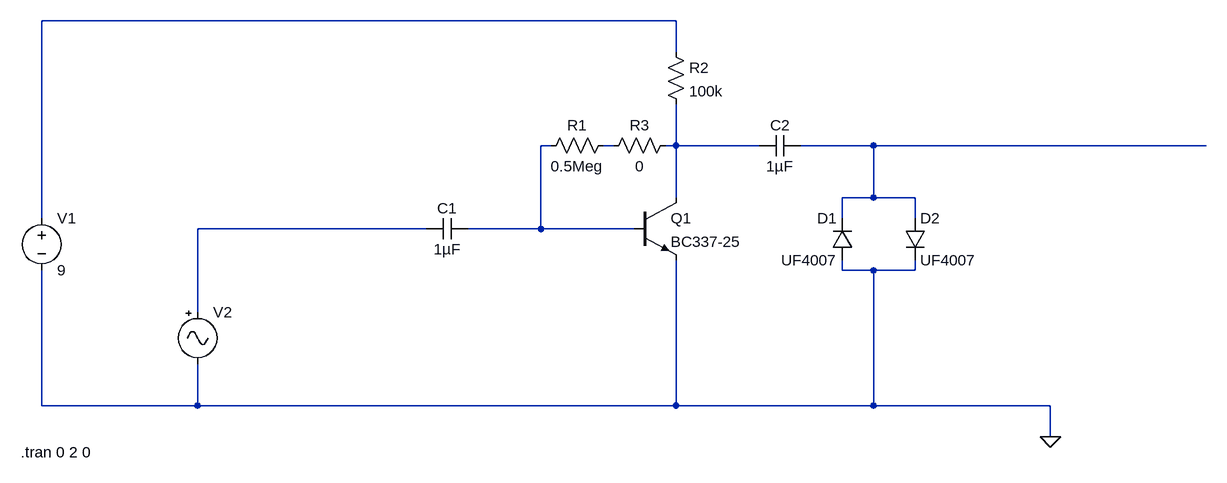
[diagram p0: schematic distortion 00.asc]
distortion 00.asc, the LTspice schematic file:
Version 4
SHEET 1 1700 680
WIRE 480 -224 -496 -224
WIRE 480 -176 480 -224
WIRE 288 -32 272 -32
WIRE 384 -32 368 -32
WIRE 480 -32 480 -96
WIRE 480 -32 464 -32
WIRE 608 -32 480 -32
WIRE 784 -32 672 -32
WIRE 1296 -32 784 -32
WIRE 480 48 480 -32
WIRE 784 48 784 -32
WIRE 784 48 736 48
WIRE 848 48 784 48
WIRE -496 80 -496 -224
WIRE 736 80 736 48
WIRE 848 80 848 48
WIRE 96 96 -256 96
WIRE 272 96 272 -32
WIRE 272 96 160 96
WIRE 416 96 272 96
WIRE 736 160 736 144
WIRE 784 160 736 160
WIRE 848 160 848 144
WIRE 848 160 784 160
WIRE -256 224 -256 96
WIRE -496 368 -496 160
WIRE -256 368 -256 304
WIRE -256 368 -496 368
WIRE 480 368 480 144
WIRE 480 368 -256 368
WIRE 784 368 784 160
WIRE 784 368 480 368
WIRE 1056 368 784 368
WIRE 1056 416 1056 368
FLAG 1056 416 0
SYMBOL voltage -496 64 R0
WINDOW 123 0 0 Left 0
WINDOW 39 0 0 Left 0
SYMATTR InstName V1
SYMATTR Value 9
SYMBOL res 384 -48 R90
WINDOW 0 0 56 VBottom 2
WINDOW 3 32 56 VTop 2
SYMATTR InstName R1
SYMATTR Value 0.5Meg
SYMATTR SpiceLine tol=2 pwr=0.1
SYMBOL res 464 -192 R0
SYMATTR InstName R2
SYMATTR Value 100k
SYMBOL diode 752 144 R180
WINDOW 0 24 64 Left 2
WINDOW 3 24 0 Left 2
SYMATTR InstName D1
SYMATTR Value UF4007
SYMBOL Misc\\signal -256 208 R0
WINDOW 123 24 44 Left 2
WINDOW 39 0 0 Left 0
WINDOW 3 24 104 Invisible 2
SYMATTR Value PULSE(-0.2 0.2 0 0.0011356 0.0011356 0 0.0011356 1000)
SYMATTR InstName V2
SYMBOL npn 416 48 R0
SYMATTR InstName Q1
SYMATTR Value BC337-25
SYMBOL diode 832 80 R0
SYMATTR InstName D2
SYMATTR Value UF4007
SYMBOL cap 672 -48 R90
WINDOW 0 0 32 VBottom 2
WINDOW 3 32 32 VTop 2
SYMATTR InstName C2
SYMATTR Value 1µF
SYMATTR SpiceLine Irms=1
SYMBOL cap 160 80 R90
WINDOW 0 0 32 VBottom 2
WINDOW 3 32 32 VTop 2
SYMATTR InstName C1
SYMATTR Value 1µF
SYMATTR SpiceLine Irms=1
SYMBOL res 480 -48 R90
WINDOW 0 0 56 VBottom 2
WINDOW 3 32 56 VTop 2
SYMATTR InstName R3
SYMATTR Value 0
TEXT -528 440 Left 2 !.tran 0 2 0

The netlist it stands for:
* distortion 00.asc
V1 N001 0 9
R1 N003 N002 0.5Meg tol=2 pwr=0.1
R2 N001 N004 100k
D1 0 N005 UF4007
V2 N006 0 PULSE(-0.2 0.2 0 0.0011356 0.0011356 0 0.0011356 1000)
Q1 N004 N002 0 0 BC337-25
D2 N005 0 UF4007
C2 N005 N004 1µF Irms=1
C1 N002 N006 1µF Irms=1
R3 N004 N003 0
.model D D
.lib standard.dio
.model NPN NPN
.model PNP PNP
.lib standard.bjt
.tran 0 2 0
.backanno
.end